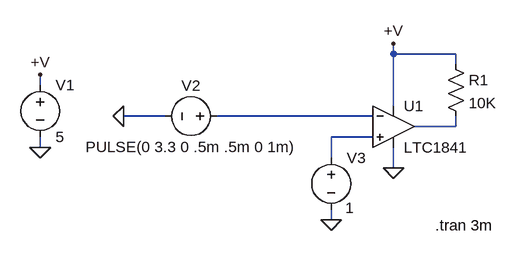
[diagram p0: schematic 1841.asc]
1841.asc, the LTspice schematic file:
Version 4
SHEET 1 1144 800
WIRE 544 96 544 80
WIRE 640 96 544 96
WIRE 640 112 640 96
WIRE 0 144 0 128
WIRE 544 176 544 96
WIRE 192 192 128 192
WIRE 512 192 272 192
WIRE 640 208 640 192
WIRE 640 208 576 208
WIRE 512 224 448 224
WIRE 0 240 0 224
WIRE 448 256 448 224
WIRE 544 272 544 240
WIRE 448 352 448 336
FLAG 0 240 0
FLAG 0 128 +V
FLAG 128 192 0
FLAG 544 80 +V
FLAG 544 272 0
FLAG 448 352 0
SYMBOL voltage 0 128 R0
SYMATTR InstName V1
SYMATTR Value 5
SYMBOL voltage 288 192 R90
WINDOW 3 32 56 VTop 2
WINDOW 0 -32 56 VBottom 2
WINDOW 123 0 0 Left 2
WINDOW 39 0 0 Left 2
SYMATTR Value PULSE(0 3.3 0 .5m .5m 0 1m)
SYMATTR InstName V2
SYMBOL res 624 96 R0
SYMATTR InstName R1
SYMATTR Value 10K
SYMBOL Comparators\\LTC1841 544 208 R0
SYMATTR InstName U1
SYMBOL voltage 448 240 R0
WINDOW 3 22 93 Left 2
SYMATTR Value 1
SYMATTR InstName V3
TEXT 608 360 Left 2 !.tran 3m

The netlist it stands for:
* 1841.asc
V1 +V 0 5
V2 N001 0 PULSE(0 3.3 0 .5m .5m 0 1m)
R1 +V N002 10K
* U1: LTC1841 (symbol Comparators\LTC1841 not available, pins judged from their places): In+=N003 In-=N001 V+=+V V-=0 OUT=N002
V3 N003 0 1
.tran 3m
.backanno
.end